# EAGLE design QO100_control (EAGLE 7.3.0)
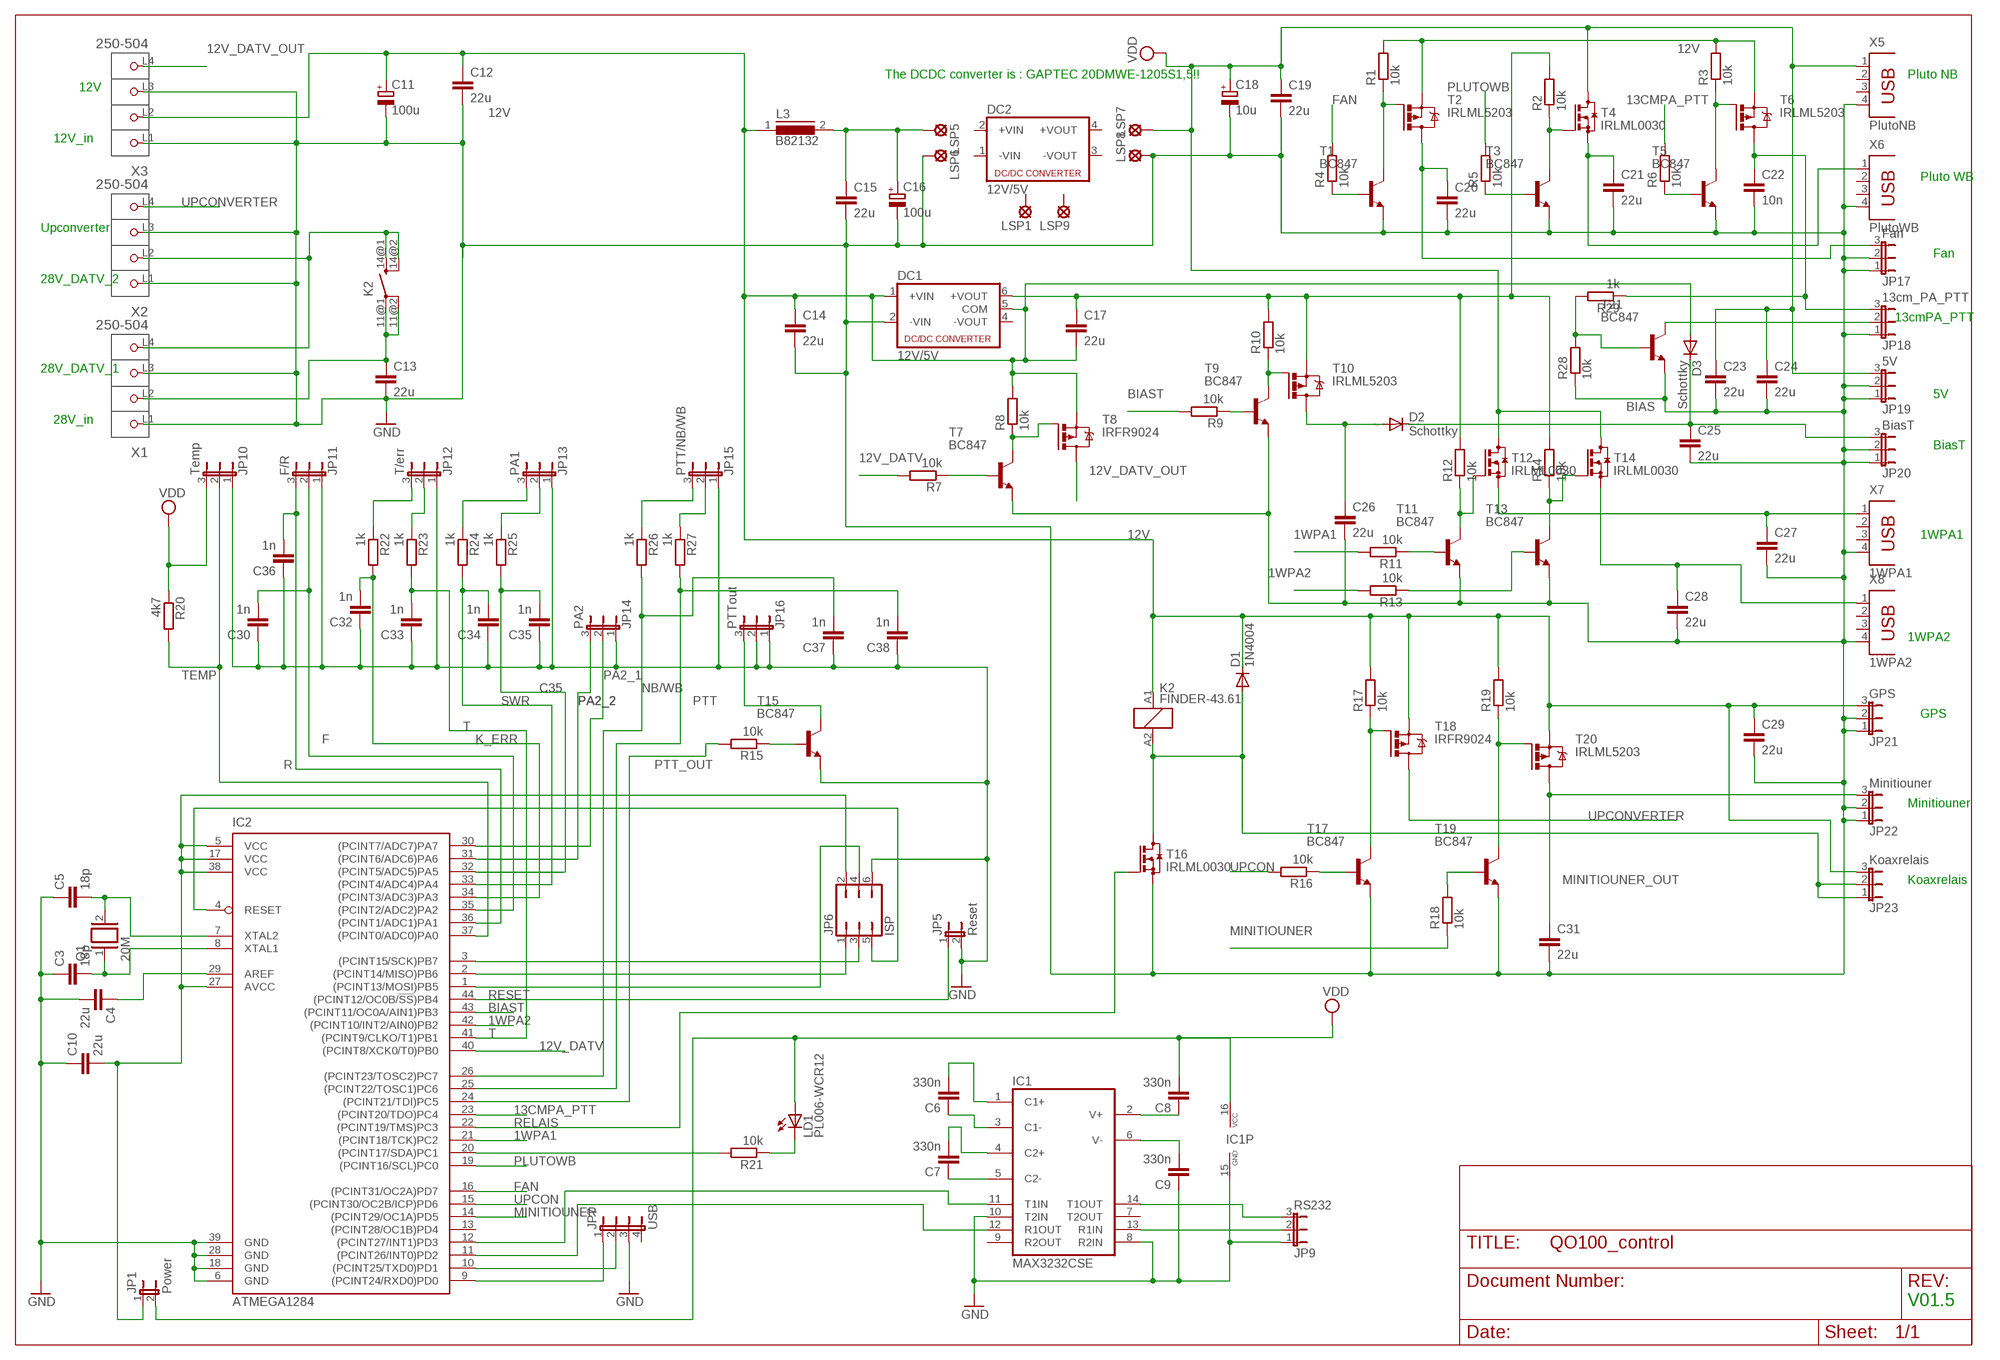
[diagram p0: schematic, sheet 1]

## Parts
C3  18p  C-EU025-025X050  [C025-025X050]
C4  22u  C-EUC1206  [C1206]
C5  18p  C-EU025-025X050  [C025-025X050]
C6  330n  C-EUC1206  [C1206]
C7  330n  C-EUC1206  [C1206]
C8  330n  C-EUC1206  [C1206]
C9  330n  C-EUC1206  [C1206]
C10  22u  C-EUC1206  [C1206]
C11  100u  CPOL-EUE5-6  [E5-6]
C12  22u  C-EUC1206  [C1206]
C13  22u  C-EUC1206  [C1206]
C14  22u  C-EUC1206  [C1206]
C15  22u  C-EUC1206  [C1206]
C16  100u  CPOL-EUE5-6  [E5-6]
C17  22u  C-EUC1206  [C1206]
C18  10u  CPOL-EUE5-6  [E5-6]
C19  22u  C-EUC1206  [C1206]
C20  22u  C-EUC1206  [C1206]
C21  22u  C-EUC1206  [C1206]
C22  10n  C-EUC1206  [C1206]
C23  22u  C-EUC1206  [C1206]
C24  22u  C-EUC1206  [C1206]
C25  22u  C-EUC1206  [C1206]
C26  22u  C-EUC1206  [C1206]
C27  22u  C-EUC1206  [C1206]
C28  22u  C-EUC1206  [C1206]
C29  22u  C-EUC1206  [C1206]
C30  1n  C-EUC1206  [C1206]
C31  22u  C-EUC1206  [C1206]
C32  1n  C-EUC1206  [C1206]
C33  1n  C-EUC1206  [C1206]
C34  1n  C-EUC1206  [C1206]
C35  1n  C-EUC1206  [C1206]
C36  1n  C-EUC1206  [C1206]
C37  1n  C-EUC1206  [C1206]
C38  1n  C-EUC1206  [C1206]
D1  1N4004  [DO41-10]
D2  Schottky  1N4004  [DO41-10]
D3  Schottky  1N4004  [DO41-10]
DC1  12V/5V  NMA  [NMA]
DC2  12V/5V  NME  [NME]
IC1  MAX3232CSE  [SO16]
IC2  ATMEGA1284  ATMEGA644A  [TQFP44]
JP1  Power  JP1E  [JP1]
JP5  Reset  JP1E  [JP1]
JP6  ISP  JP3Q  [JP3Q]
JP7  USB  JP4E  [JP4]
JP9  RS232  JP2E  [JP2]
JP10  Temp  JP2E  [JP2]
JP11  F/R  JP2E  [JP2]
JP12  T/err  JP2E  [JP2]
JP13  PA1  JP2E  [JP2]
JP14  PA2  JP2E  [JP2]
JP15  PTT/NB/WB  JP2E  [JP2]
JP16  PTTout  JP2E  [JP2]
JP17  Fan  JP2E  [JP2]
JP18  13cm_PA_PTT  JP2E  [JP2]
JP19  5V  JP2E  [JP2]
JP20  BiasT  JP2E  [JP2]
JP21  GPS  JP2E  [JP2]
JP22  Minitiouner  JP2E  [JP2]
JP23  Koaxrelais  JP2E  [JP2]
K2  FINDER-43.61  [FINDER-43.61]
L3  B82132  [SUKW2-22]
LD1  PL006-WCR12  [SOT23]
LSP1  SE14  [SE14]
LSP5  SE14  [SE14]
LSP6  SE14  [SE14]
LSP7  SE14  [SE14]
LSP8  SE14  [SE14]
LSP9  SE14  [SE14]
Q1  20M  XTAL/S  [QS]
R1  10k  R-EU_R1206  [R1206]
R2  10k  R-EU_R1206  [R1206]
R3  10k  R-EU_R1206  [R1206]
R4  10k  R-EU_R1206  [R1206]
R5  10k  R-EU_R1206  [R1206]
R6  10k  R-EU_R1206  [R1206]
R7  10k  R-EU_R1206  [R1206]
R8  10k  R-EU_R1206  [R1206]
R9  10k  R-EU_R1206  [R1206]
R10  10k  R-EU_R1206  [R1206]
R11  10k  R-EU_R1206  [R1206]
R12  10k  R-EU_R1206  [R1206]
R13  10k  R-EU_R1206  [R1206]
R14  10k  R-EU_R1206  [R1206]
R15  10k  R-EU_R1206  [R1206]
R16  10k  R-EU_R1206  [R1206]
R17  10k  R-EU_R1206  [R1206]
R18  10k  R-EU_R1206  [R1206]
R19  10k  R-EU_R1206  [R1206]
R20  4k7  R-EU_R1206  [R1206]
R21  10k  R-EU_R1206  [R1206]
R22  1k  R-EU_R1206  [R1206]
R23  1k  R-EU_R1206  [R1206]
R24  1k  R-EU_R1206  [R1206]
R25  1k  R-EU_R1206  [R1206]
R26  1k  R-EU_R1206  [R1206]
R27  1k  R-EU_R1206  [R1206]
R28  10k  R-EU_R1206  [R1206]
R29  1k  R-EU_R1206  [R1206]
T1  BC847  [SOT23]
T2  IRLML5203  [MICRO3]
T3  BC847  [SOT23]
T4  IRLML0030  BSS123  [SOT23]
T5  BC847  [SOT23]
T6  IRLML5203  [MICRO3]
T7  BC847  [SOT23]
T8  IRFR9024  IRFR5305  [D-PAK_TO252AA]
T9  BC847  [SOT23]
T10  IRLML5203  [MICRO3]
T11  BC847  [SOT23]
T12  IRLML0030  BSS123  [SOT23]
T13  BC847  [SOT23]
T14  IRLML0030  BSS123  [SOT23]
T15  BC847  [SOT23]
T16  IRLML0030  BSS123  [SOT23]
T17  BC847  [SOT23]
T18  IRFR9024  IRFR5305  [D-PAK_TO252AA]
T19  BC847  [SOT23]
T20  IRLML5203  [MICRO3]
T21  BC847  [SOT23]
X1  250-504  [P-250-504]
X2  250-504  [P-250-504]
X3  250-504  [P-250-504]
X5  PlutoNB  PN87520  [PN87520]
X6  PlutoWB  PN87520  [PN87520]
X7  1WPA1  PN87520  [PN87520]
X8  1WPA2  PN87520  [PN87520]

## Nets
1WPA1: IC2.21((PCINT18/TCK)PC2) R11.2
1WPA2: IC2.42((PCINT10/INT2/AIN0)PB2) R13.2
12V: C11.+ C12.1 C14.1 C17.2 C29.1 D1.C D3.A DC1.1(+VIN) DC1.5(COM) JP21.3 JP23.3 K2.A1 L3.1 R1.2 R3.2 R8.2 R17.2 R19.2 T2.2(S) T6.2(S) T8.3(S) T18.3(S) T20.2(S) X3.L2(P2)
12V_DATV: IC2.40((PCINT8/XCK0/T0)PB0) R7.2
12V_DATV_OUT: T8.4(D) X3.L4(P4)
13CMPA_PTT: IC2.23((PCINT20/TDO)PC4) R6.2
28V: K2.14@1(-1:SA) K2.14@2(-1:SB) X1.L4(P4) X2.L2(P2)
BIAS: C25.1 D2.C D3.C JP20.3
BIAST: IC2.43((PCINT11/OC0A/AIN1)PB3) R9.2
C35: C35.2 IC2.32((PCINT5/ADC5)PA5) R25.2
DFGJKN: C26.1 D2.A T10.3(D)
F: C30.2 IC2.35((PCINT2/ADC2)PA2) JP11.2
FAN: IC2.16((PCINT31/OC2A)PD7) R4.2
GND: C3.1 C4.2 C5.1 C9.1 C10.1 C11.- C12.2 C13.2 C14.2 C15.2 C16.- C18.- C19.2 C20.2 C21.2 C22.2 C23.2 C24.2 C25.2 C26.2 C27.2 C28.2 C29.2 C30.1 C31.2 C32.1 C33.1 C34.1 C35.1 C36.1 C37.1 C38.1 DC1.2(-VIN) IC1.8(R2IN) IC1.10(T2IN) IC1.15(GND) IC2.6(GND) IC2.18(GND) IC2.28(GND) IC2.39(GND) JP5.2 JP6.6 JP7.3 JP9.1 JP10.1 JP11.1 JP12.1 JP13.1 JP14.1 JP15.1 JP16.1 JP16.2 JP17.1 JP17.2 JP18.1 JP19.1 JP19.2 JP20.1 JP20.2 JP21.1 JP21.2 JP22.1 JP22.2 LSP6.MP LSP8.MP R28.1 T1.2(E) T3.2(E) T5.2(E) T7.2(E) T9.2(E) T11.2(E) T13.2(E) T15.2(E) T16.2(S) T17.2(E) T19.2(E) T21.2(E) X1.L1(P1) X1.L3(P3) X2.L1(P1) X2.L3(P3) X3.L1(P1) X3.L3(P3) X5.4 X6.4 X7.4 X8.4
K_ERR: C32.2 IC2.34((PCINT3/ADC3)PA3) R22.2
MINITIOUNER: IC2.14((PCINT29/OC1A)PD5) R18.1
MINITIOUNER_OUT: C31.1 JP22.3 T20.3(D)
N$1: IC2.20((PCINT17/SDA)PC1) R21.2
N$2: C22.1 JP18.3 R29.1 T6.3(D)
N$3: C28.1 T14.2(S) X8.1
N$4: IC2.3((PCINT15/SCK)PB7) JP6.3
N$5: R17.1 T17.3(C) T18.1(G)
N$6: C5.2 IC2.7(XTAL2) Q1.2
N$7: C15.1 C16.+ L3.2 LSP5.MP
N$8: R8.1 T7.3(C) T8.1(G)
N$9: LD1.3(C) R21.1
N$10: C3.2 IC2.8(XTAL1) Q1.1
N$11: R7.1 T7.1(B)
N$12: JP12.3 R22.1
N$13: IC2.2((PCINT14/MISO)PB6) JP6.1
N$14: C6.2 IC1.1(C1+)
N$15: IC2.1((PCINT13/MOSI)PB5) JP6.4
N$16: IC2.4(RESET) JP6.5
N$17: IC2.9((PCINT24/RXD0)PD0) JP7.1
N$18: IC2.10((PCINT25/TXD0)PD1) JP7.2
N$19: IC1.12(R1OUT) IC2.11((PCINT26/INT0)PD2)
N$20: C4.1 IC2.29(AREF)
N$21: IC1.11(T1IN) IC2.12((PCINT27/INT1)PD3)
N$22: JP12.2 R23.1
N$23: JP13.2 R25.1
N$24: JP13.3 R24.1
N$25: JP15.3 R26.1
N$26: C27.1 T12.2(S) X7.1
N$27: JP15.2 R27.1
N$28: D1.A JP23.1 JP23.2 K2.A2 T16.3(D)
N$29: C6.1 IC1.3(C1-)
N$30: C7.1 IC1.5(C2-)
N$31: C7.2 IC1.4(C2+)
N$32: JP18.2 T21.3(C)
N$33: IC1.14(T1OUT) JP9.3
N$34: C9.2 IC1.6(V-)
N$35: C8.1 IC1.2(V+)
N$36: IC1.13(R1IN) JP9.2
N$38: R28.2 R29.2 T21.1(B)
N$40: R3.1 T5.3(C) T6.1(G)
N$41: JP16.3 T15.3(C)
N$42: C21.1 T4.2(S) X6.1
N$43: R15.1 T15.1(B)
N$44: R19.1 T19.3(C) T20.1(G)
N$45: R10.1 T9.3(C) T10.1(G)
N$46: R6.1 T5.1(B)
N$47: C20.1 JP17.3 T2.3(D)
N$48: R2.1 T3.3(C) T4.1(G)
N$49: R12.1 T11.3(C) T12.1(G)
N$50: R1.1 T1.3(C) T2.1(G)
N$51: C17.1 DC1.6(+VOUT) R2.2 R10.2 R12.2 R14.2 T10.2(S)
N$52: R14.1 T13.3(C) T14.1(G)
N$53: R4.1 T1.1(B)
N$54: R5.1 T3.1(B)
N$55: R9.1 T9.1(B)
N$56: R11.1 T11.1(B)
N$57: R13.1 T13.1(B)
N$58: R16.1 T17.1(B)
N$59: C13.1 K2.11@1(-1:PA) K2.11@2(-1:PB) X1.L2(P2)
N$60: R18.2 T19.1(B)
NB/WB: C37.2 IC2.26((PCINT23/TOSC2)PC7) R26.2
PA2_1: IC2.30((PCINT7/ADC7)PA7) JP14.2
PA2_2: IC2.31((PCINT6/ADC6)PA6) JP14.3
PLUTOWB: IC2.19((PCINT16/SCL)PC0) R5.2
PTT: C38.2 IC2.25((PCINT22/TOSC1)PC6) R27.2
PTT_OUT: IC2.24((PCINT21/TDI)PC5) R15.2
R: C36.2 IC2.36((PCINT1/ADC1)PA1) JP11.3
RELAIS: IC2.22((PCINT19/TMS)PC3) T16.1(G)
RESET: IC2.44((PCINT12/OC0B/!SS!)PB4) JP5.1
SWR: C34.2 IC2.33((PCINT4/ADC4)PA4) R24.2
T: C33.2 IC2.41((PCINT9/CLKO/T1)PB1) R23.2
TEMP: IC2.37((PCINT0/ADC0)PA0) JP10.2 R20.2
UPCON: IC2.15((PCINT30/OC2B/ICP)PD6) R16.2
UPCONVERTER: T18.4(D) X2.L4(P4)
VCC: C10.2 IC2.5(VCC) IC2.17(VCC) IC2.27(AVCC) IC2.38(VCC) JP1.1 JP6.2
VDD: C8.2 C18.+ C19.1 C23.1 C24.1 IC1.16(VCC) JP1.2 JP10.3 JP19.3 LD1.1(A) LSP7.MP R20.1 T4.3(D) T12.3(D) T14.3(D) X5.1
Unconnected: DC1.4(-VOUT) DC2.1(-VIN) DC2.2(+VIN) DC2.3(-VOUT) DC2.4(+VOUT) IC1.7(T2OUT) IC1.9(R2OUT) IC2.13((PCINT28/OC1B)PD4) JP7.4 LSP1.MP LSP9.MP X5.2 X5.3 X6.2 X6.3 X7.2 X7.3 X8.2 X8.3

## Notes on the sheet
- The DCDC converter is : GAPTEC 20DMWE-1205S1,5!! | Pluto NB
- 12V
- 12V_in
- Pluto WB
- Upconverter
- Fan
- 28V_DATV_2
- 13cmPA_PTT
- 28V_DATV_1
- 5V
- 28V_in
- BiasT
- 1WPA1
- 1WPA2
- GPS
- Minitiouner
- Koaxrelais
- V01.5

## Library data of the parts
C3 C5 = rcl:C-EU: CAPACITOR, European symbol
C4 C6-C10 C12-C15 C17 C19-C38 = resistor:C-EU: CAPACITOR, European symbol
C11 C16 C18 = resistor:CPOL-EU: POLARIZED CAPACITOR, European symbol
D1-D3 = diode:1N4004: DIODE general purpose rectifier, 1 A
DC1 = dc-dc-converter:NMA: DC-DC CONVERTER; MF: C & D TECHNOLOGIES, INC; MPN: NMA0515SC; OC_FARNELL: 1021434; OC_NEWARK: 61K3064
DC2 = dc-dc-converter:NME: DC-DC CONVERTER; MF: C & D TECHNOLOGIES, INC; MPN: NME1205D; OC_FARNELL: 1021466; OC_NEWARK: 98B8198
IC1 = maxim:MAX3232*: True RS-232 Transceivers 3.0V to 5.5V, Low-Power up to 1Mbps, Using Four 0.1µF External Capacitors Source: http://pdfserv.maxim-ic.com/en/ds/MAX3222-MAX3241.pdf; MPN: MAX3232CSE; OC_FARNELL: 9725490; OC_NEWARK: 90C2890
IC2 = atmel:ATMEGA644: 8-bit Microcontroller with 64K Bytes In-System Programmable Flash Source: http://www.atmel.com/dyn/resources/prod_documents/doc2593.pdf; MPN: ATMEGA644PV-10AU; OC_FARNELL: 1455123; OC_NEWARK: 58M3748
JP1 JP5 = jumper:JP1E: JUMPER
JP6 = jumper:JP3Q: JUMPER
JP7 = jumper:JP4E: JUMPER
JP9-JP23 = jumper:JP2E: JUMPER
K2 = relay:FINDER-43.61: Low profile PCB relays 10 - 16 A FINDER 43 Series Kontakt max. AC- 250V, Strom - Kontakt AC- max. 10A 5 mm contact pin pitch, 1 Pole NO, 16 A, PCB mount Distributor: FARNELL Source: http://www.farnell.com/datasheets/87682.pdf; OC_FARNELL: unknown; OC_NEWARK: unknown
L3 = inductors:B82132: INDUCTOR
LD1 = led:PL006*: PLH006 Series SMD LED SOT23 PLH006-WCR21 Super Red PLH006-WCR12 High Eff Red PLH006-WCG13 Green PLH006-WCY01 Yellow www.p-tec.net Source: http://www.wittig-electronic.de/PTEC/PL006Series.pdf
LSP1 LSP5-LSP9 = solpad:SE14: SOLDER PAD E1553, drill 1,4mm, distributor Buerklin, 07F820
Q1 = special:XTAL/S: CRYSTAL
R1-R29 = rcl:R-EU_: RESISTOR, European symbol
T1 T3 T5 T7 T9 T11 T13 T15 T17 T19 T21 = transistor:BC847: NPN TRANSISTOR
T2 T6 T10 T20 = transistor-power:IRLML5203: HEXFET P-Channel Power MOSFET
T4 T12 T14 T16 = transistor-small-signal:BSS123: N-CHANNEL MOS FET
T8 T18 = transistor-power:IRF?5305: HEXFET Power MOSFET Source: http://www.irf.com/product-info/datasheets/data/irfr5305pbf.pdf
X1-X3 = 250-504:250-504: Serie 250, 1-Leiter-Klemmenleiste für Leiterplatten 1 Lötstift/Pol in Reihe / Series 250, 1-conductor PCB terminal strip 1 solder pin/pole, in line Polzahl / Pole No.: 4 Rastermaß / Pitch: 5 mm Bemessungsspannung / Rated Voltage: 320 V Nennstrom / Nominal Current: 17.5 A Leiterquerschnitt / Conductor Size: 0.5 - 1.5 mm² Anschlusstechnik / Connection Technology: Steckklemm-Anschluss Lötstiftlänge: / Solder Pin Length: 4 mm Leitereinführung (zur Platine) / Conductor entry angle (to PCB): 45 ° Farbe / Color: grau / gray Stand: 01.01.2012. Die jeweils aktuellen Daten zu diesem Artikel finden Sie in unserem Produktkatalog, den Sie unter www.wago.com einsehen können. As of: 01/01/2012. Please find the newest data for this article in our product catalogue, which can be viewed under www.wago.com. Check availability <https://pricing.snapeda.com/parts/250-504/WAGO/view-part?ref=eda>; AVAILABILITY: In Stock; DESCRIPTION: PCB Terminal Block Rating to EN: 10 A @ 400 VAC/VDC Rating to UL/CSA: 2 A @ 300 VAC/VDC Temperature range: -35 ... +105 °C Connection cross-section: 0.5...1.5 mm² solid or stranded Combustibility class: UL 94 V-0 Connection direction: 45° Housing Material: Polyamide (PA 66) Pitch: 5 mm Termination type: Spring Clamp Terminals Poles: 4 Rated current to EN: 10 A Rated current to UL/CSA: 2 A Rated voltage to EN: 400 VAC/VDC Rated voltage to UL/CSA: 300 VAC/VDC; MF: WAGO; MP: 250-504; PACKAGE: None; PRICE: None; PURCHASE-URL: https://pricing.snapeda.com/search/part/250-504/?ref=eda
X5-X8 = con-berg:PN87520: BERG USB connector; OC_FARNELL: unknown; OC_NEWARK: unknown

## Board
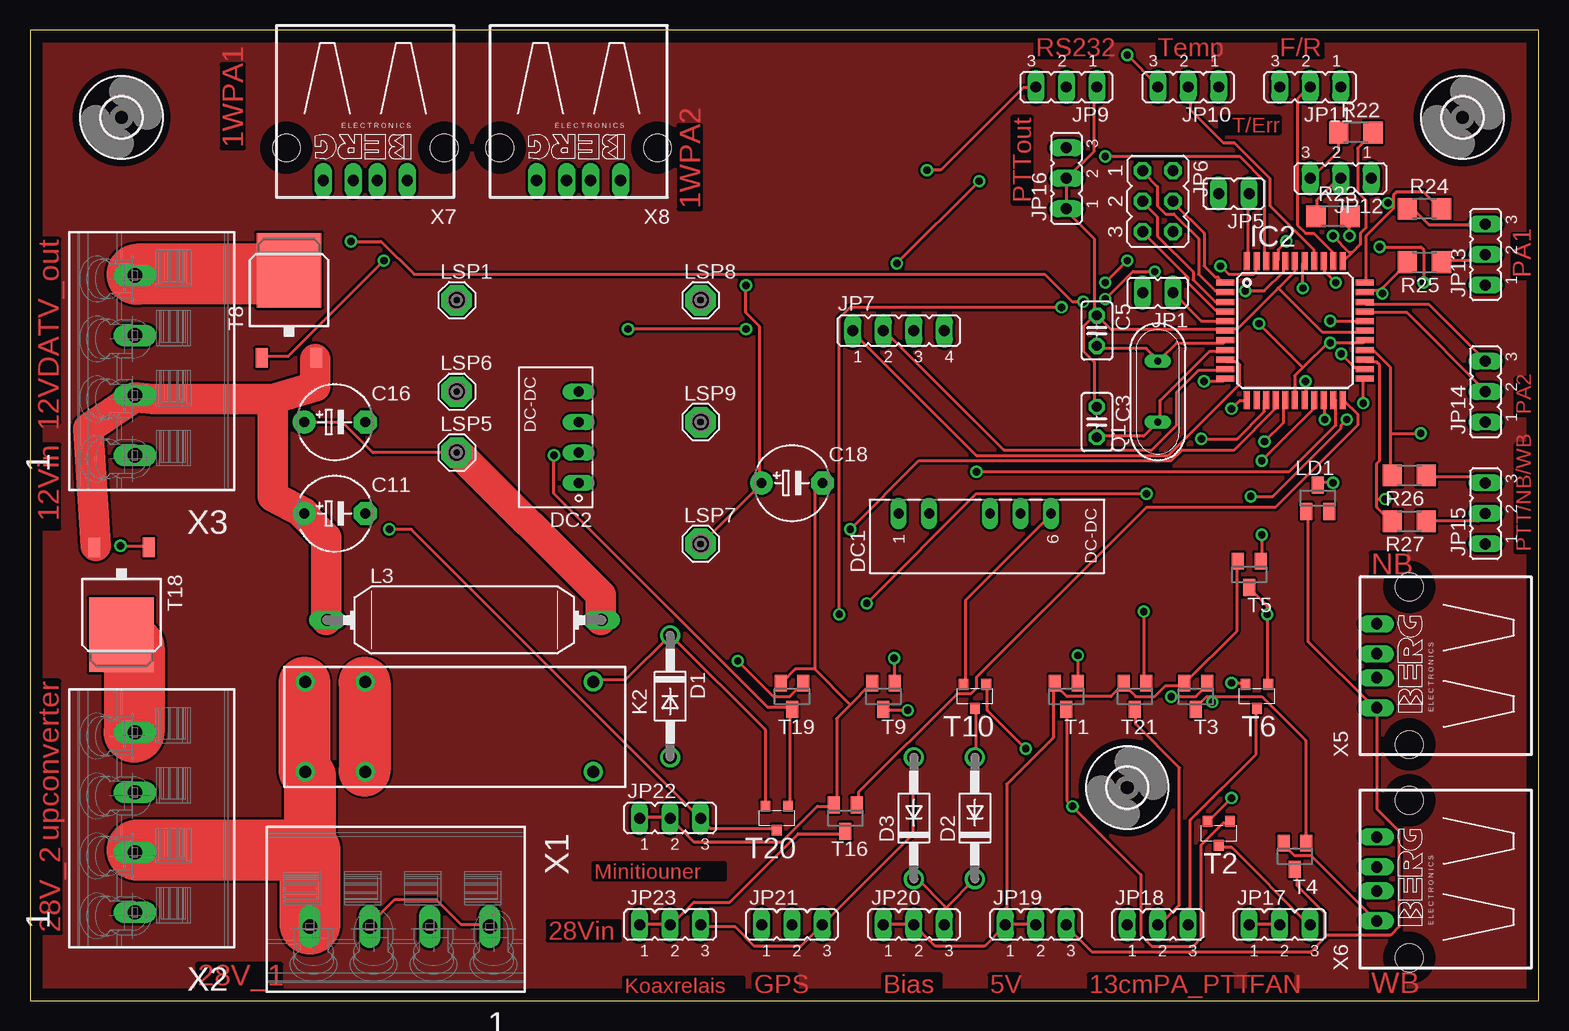
[diagram p1: board, top side]
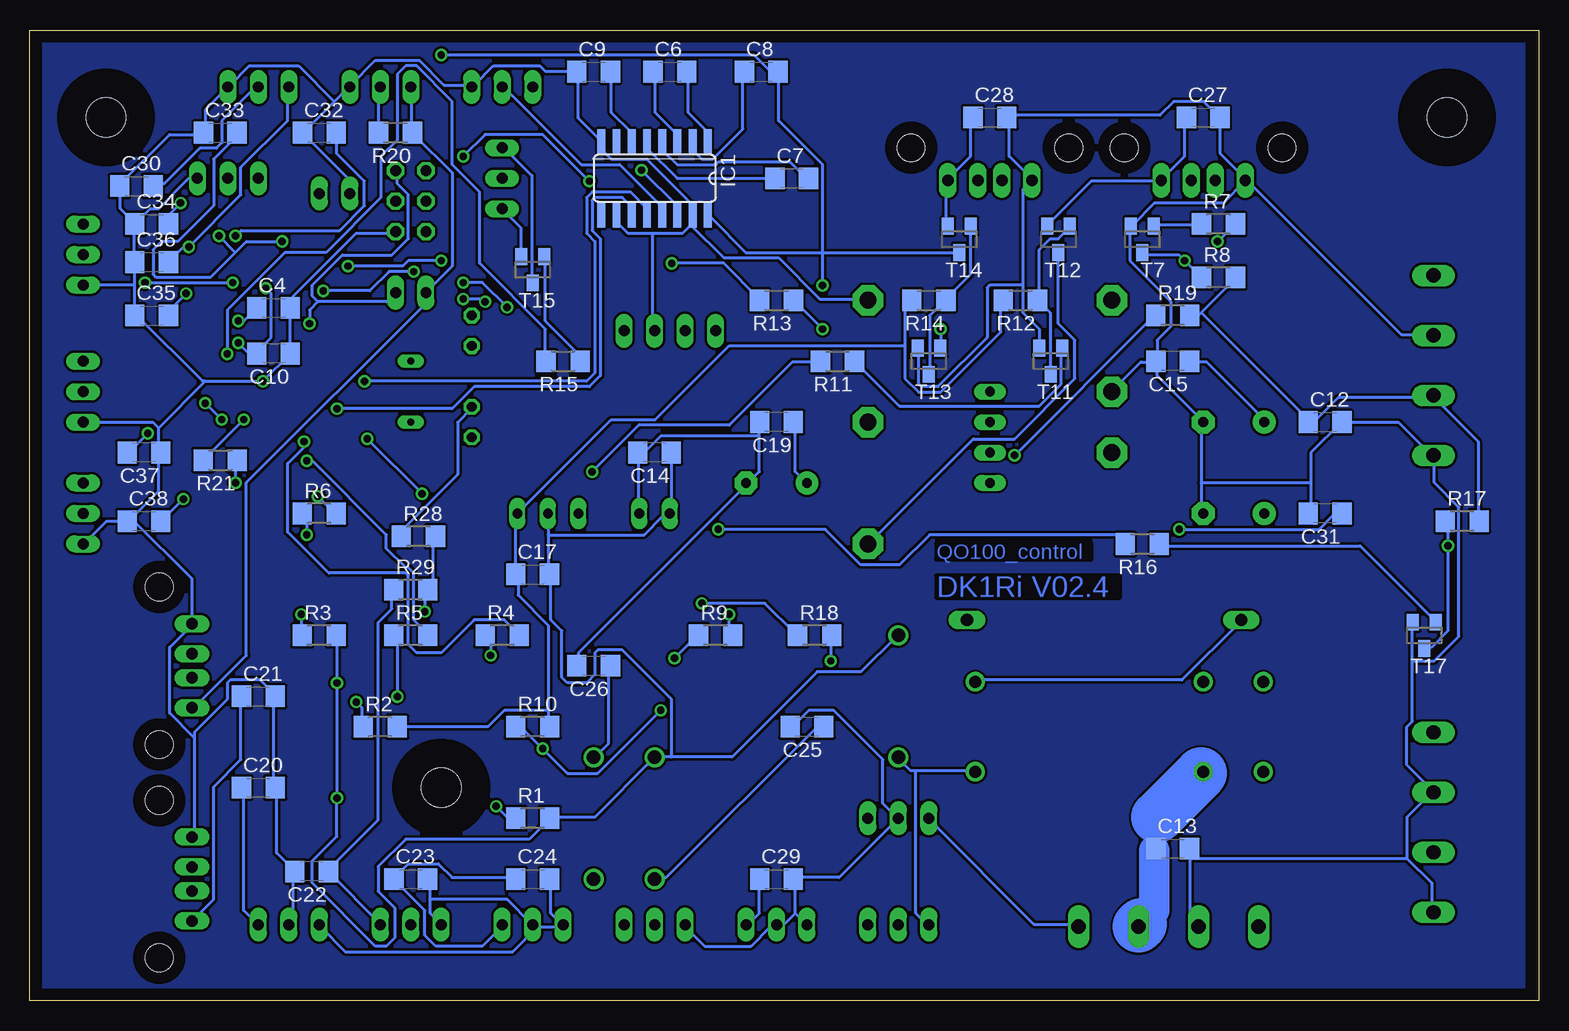
[diagram p2: board, bottom side, seen from below]

Size 125.71 x 80.95 mm. Coordinates in mm from the lower left corner, seen from the top.
Outline: 0,0 125.71,0 125.71,80.95 0,80.95 0,0
Copper layers (1*16): Top 0.035mm / dielectric 1.5mm / Bottom 0.035mm
Design rules "default": minimum track width 10mil, minimum drill 24mil, track to track 8mil, track to pad 8mil, pad to pad 8mil, via to via 8mil, smd to smd 8mil, copper to edge 40mil, drill to drill 8mil, minimum pad ring 10mil, minimum via ring 8mil, stop-mask expansion 4mil, vias tented up to drill 0mil, thermal gap 10mil

### Footprints (pad centres in the part's own frame; a part is rotated, then mirrored left to right if it is on the bottom)
C025-025X050 = drill 0.813 octagon: 1 -1.27,0; 2 1.27,0
C1206 = smd 1.6 x 1.8: 1 -1.4,0; 2 1.4,0
E5-6 = drill 0.813 pad 1.905: + -2.54,0 | drill 0.813 pad 1.905 octagon: - 2.54,0
DO41-10 = drill 1.118: A 5.08,0; C -5.08,0
NMA = drill 0.813 long: 1 0,6.35; 2 0,3.81; 4 0,-1.27; 5 0,-3.81; 6 0,-6.35
NME = drill 0.813 long: 1 0,3.81; 2 0,1.27; 3 0,-1.27; 4 0,-3.81
SO16 = smd 0.66 x 2.032: 1 -4.445,-3.073; 2 -3.175,-3.073; 3 -1.905,-3.073; 4 -0.635,-3.073; 5 0.635,-3.073; 6 1.905,-3.073; 7 3.175,-3.073; 8 4.445,-3.073; 9 4.445,3.073; 10 3.175,3.073; 11 1.905,3.073; 12 0.635,3.073; 13 -0.635,3.073; 14 -1.905,3.073; 15 -3.175,3.073; 16 -4.445,3.073
TQFP44 = smd 1.5 x 0.5: 1 -5.8,4; 2 -5.8,3.2; 3 -5.8,2.4; 4 -5.8,1.6; 5 -5.8,0.8; 6 -5.8,0; 7 -5.8,-0.8; 8 -5.8,-1.6; 9 -5.8,-2.4; 10 -5.8,-3.2; 11 -5.8,-4; 23 5.8,-4; 24 5.8,-3.2; 25 5.8,-2.4; 26 5.8,-1.6; 27 5.8,-0.8; 28 5.8,0; 29 5.8,0.8; 30 5.8,1.6; 31 5.8,2.4; 32 5.8,3.2; 33 5.8,4 | smd 0.5 x 1.5: 12 -4,-5.8; 13 -3.2,-5.8; 14 -2.4,-5.8; 15 -1.6,-5.8; 16 -0.8,-5.8; 17 0,-5.8; 18 0.8,-5.8; 19 1.6,-5.8; 20 2.4,-5.8; 21 3.2,-5.8; 22 4,-5.8; 34 4,5.8; 35 3.2,5.8; 36 2.4,5.8; 37 1.6,5.8; 38 0.8,5.8; 39 0,5.8; 40 -0.8,5.8; 41 -1.6,5.8; 42 -2.4,5.8; 43 -3.2,5.8; 44 -4,5.8
JP1 = drill 0.914 long: 1 0,-1.27; 2 0,1.27
JP3Q = drill 0.914 octagon: 1 -2.54,-1.27; 2 -2.54,1.27; 3 0,-1.27; 4 0,1.27; 5 2.54,-1.27; 6 2.54,1.27
JP4 = drill 0.914 long: 1 -3.81,0; 2 -1.27,0; 3 1.27,0; 4 3.81,0
JP2 = drill 0.914 long: 1 -2.54,0; 2 0,0; 3 2.54,0
FINDER-43.61 = drill 1 pad 1.6: 11@1 0,3.75; 11@2 0,-3.75; 14@1 5,3.75; 14@2 5,-3.75; A1 -19,-3.75; A2 -19,3.75
SUKW2-22 = drill 1.016 long: 1 -11.43,0; 2 11.43,0
SOT23 = smd 1 x 1.4: 1 -0.95,-1.1; 2 0.95,-1.1; 3 0,1.1
SE14 = drill 1.397 pad 2.54 octagon: MP 0,0
QS = drill 0.61 long: 1 -2.54,0; 2 2.54,0
R1206 = smd 1.6 x 1.803: 1 -1.422,0; 2 1.422,0
MICRO3 = smd 0.8 x 0.9: 1 -0.95,-1; 2 0.95,-1; 3 0,1
D-PAK_TO252AA = smd 1 x 1.6: 1 -2.28,-4.8; 3 2.28,-4.8 | smd 5.4 x 6.2: 4 0,2.5
3,3 = hole 3.3: 0,0
P-250-504 = drill 1.2 long: L1 1.425,7.85; L2 1.425,2.85; L3 1.425,-2.15; L4 1.425,-7.15
PN87520 = drill 0.95 long: 1 -3.5,2.71; 2 -1,2.71; 3 1,2.71; 4 3.5,2.71 | hole 2.3: -6.57,0; 6.57,0

### Placement (x,y rotation side)
C3  88.9,48.26 270 top
C4  105.41,57.78 0 bottom
C5  88.9,55.88 270 top
C6  72.39,77.47 0 bottom
C7  62.23,68.58 0 bottom
C8  64.77,77.47 0 bottom
C9  78.74,77.47 0 bottom
C10  105.41,53.98 180 bottom
C11  25.4,40.64 0 top
C12  17.78,48.26 0 bottom
C13  30.48,12.7 0 bottom
C14  73.66,45.72 180 bottom
C15  30.48,53.34 180 bottom
C16  25.4,48.26 0 top
C17  83.82,35.56 0 bottom
C18  63.5,43.18 0 top
C19  63.5,48.26 180 bottom
C20  106.68,17.78 0 bottom
C21  106.68,25.4 0 bottom
C22  102.23,10.79 180 bottom
C23  93.98,10.16 0 bottom
C24  83.82,10.16 0 bottom
C25  60.96,22.86 180 bottom
C26  78.74,27.94 180 bottom
C27  27.94,73.66 0 bottom
C28  45.72,73.66 0 bottom
C29  63.5,10.16 0 bottom
C30  116.84,67.94 0 bottom
C31  17.78,40.64 180 bottom
C32  101.6,72.39 0 bottom
C33  109.86,72.39 0 bottom
C34  115.57,64.77 0 bottom
C35  115.57,57.15 0 bottom
C36  115.57,61.59 0 bottom
C37  116.2,45.72 180 bottom
C38  116.2,40.01 0 bottom
D1  53.34,25.4 270 top
D2  78.74,15.24 90 top
D3  73.66,15.24 90 top
DC1  78.74,40.64 90 top
DC2  45.72,46.99 180 top
IC1  73.66,68.58 180 bottom
IC2  105.41,55.88 0 top
JP1  93.98,59.05 90 top
JP5  100.33,67.31 90 top
JP6  93.98,66.67 270 top
JP7  72.39,55.88 0 top
JP9  86.36,76.2 180 top
JP10  96.52,76.2 180 top
JP11  106.68,76.2 180 top
JP12  109.22,68.58 180 top
JP13  121.28,62.23 90 top
JP14  121.28,50.8 90 top
JP15  121.28,40.64 90 top
JP16  86.36,68.58 90 top
JP17  104.14,6.35 0 top
JP18  93.98,6.35 0 top
JP19  83.82,6.35 0 top
JP20  73.66,6.35 0 top
JP21  63.5,6.35 0 top
JP22  53.34,15.24 0 top
JP23  53.34,6.35 0 top
K2  27.94,22.86 180 top
L3  36.2,31.75 0 top
LD1  107.31,41.91 0 top
LSP1  35.56,58.42 0 top
LSP5  35.56,45.72 0 top
LSP6  35.56,50.8 0 top
LSP7  55.88,38.1 0 top
LSP8  55.88,58.42 0 top
LSP9  55.88,48.26 0 top
Q1  93.98,50.8 90 top
R1  83.82,15.24 0 bottom
R2  96.52,22.86 0 bottom
R3  101.6,30.48 0 bottom
R4  86.36,30.48 0 bottom
R5  93.98,30.48 0 bottom
R6  101.6,40.64 0 bottom
R7  26.67,64.77 0 bottom
R8  26.67,60.33 0 bottom
R9  68.58,30.48 0 bottom
R10  83.82,22.86 0 bottom
R11  58.42,53.34 180 bottom
R12  43.18,58.42 180 bottom
R13  63.5,58.42 180 bottom
R14  50.8,58.42 180 bottom
R15  81.28,53.34 180 bottom
R16  33.02,38.1 180 bottom
R17  6.35,40.01 0 bottom
R18  60.33,30.48 0 bottom
R19  30.48,57.15 0 bottom
R20  95.25,72.39 180 bottom
R21  109.86,45.09 180 bottom
R22  110.49,72.39 0 top
R23  108.58,65.41 0 top
R24  116.2,66.04 0 top
R25  116.2,61.59 180 top
R26  114.94,43.81 180 top
R27  114.94,40.01 180 top
R28  93.34,38.73 0 bottom
R29  93.98,34.29 0 bottom
T1  86.36,25.4 180 top
T2  99.06,13.97 180 top
T3  97.16,25.4 180 top
T4  105.41,12.06 180 top
T5  101.6,35.56 180 top
T6  102.23,25.4 180 top
T7  33.02,63.5 180 bottom
T8  21.59,58.42 0 top
T9  71.12,25.4 180 top
T10  78.74,25.4 180 top
T11  40.64,53.34 180 bottom
T12  40.01,63.5 180 bottom
T13  50.8,53.34 180 bottom
T14  48.26,63.5 180 bottom
T15  83.82,60.96 180 bottom
T16  67.94,15.24 180 top
T17  9.53,30.48 180 bottom
T18  7.62,33.02 180 top
T19  63.5,25.4 180 top
T20  62.23,15.24 180 top
T21  92.08,25.4 180 top
U$1  [3,3]  7.62,73.66 0 top
U$2  [3,3]  119.38,73.66 0 top
U$3  [3,3]  91.44,17.78 0 top
X1  30.48,7.62 270 top
X2  10.16,15.24 180 top
X3  10.16,53.34 180 top
X5  114.94,27.94 90 top
X6  114.94,10.16 90 top
X7  27.94,71.12 180 top
X8  45.72,71.12 180 top

### Tracks (layer width: path | path; a pad name or v marks a point on that pad's centre or on a via)
1WPA1  (via drill 0.61)
  Top 0.254: v78.87,44.12 104.93,44.12 108.81,48.01 108.81,50.06 IC2.21
  Bottom 0.254: v78.87,44.12 74.98,48.01 67.44,48.01 62.18,53.26 59.89,53.26 R11.2
1WPA2  (via drill 0.61)
  Top 0.254: v89.61,70.41 100.81,70.41 102.87,68.35 102.87,61.72 IC2.42 | v72.24,61.49 v79.1,68.35
  Bottom 0.254: v89.61,70.41 87.78,72.24 82.98,72.24 v79.1,68.35 | v72.24,61.49 67.89,61.49 64.92,58.52 R13.2
12V  (via drill 0.61)
  Top 0.254: JP23.3 56.01,6.17 58.75,6.17 60.35,4.57 64.24,4.57 65.84,6.17 JP21.3 66.06,6.4 73.61,13.95 73.61,20.12 D3.A | T20.2 61.27,16.46 61.27,22.63 53.49,30.4 D1.C 49.61,26.75 47.09,26.75 K2.A1 | 23.77,53.49 T8.3 | 22.86,40.69 C11.+ 22.86,40.46 | 24.69,31.77 L3.1 | 5.49,37.95 T18.3 | 8.69,50.29 X3.L2 8.91,50.29 | v100.13,16.92 98.3,15.09 T2.2 | v100.13,26.52 101.27,26.52 T6.2
  Top 2.54: 23.77,53.49 23.77,51.21 20.22,50.19 | 20.22,50.19 20.22,42.06 22.86,40.69 | 24.69,31.77 24.69,38.63 22.86,40.46 | 5.49,37.95 4.85,47.73 8.69,50.29 | 20.22,50.19 10.29,50.19 8.91,50.29
  Bottom 0.254: C14.1 72.24,45.72 72.24,40.69 DC1.1 72.47,40.46 72.92,40.46 74.52,38.86 82.53,38.86 | 82.53,38.86 82.53,40.46 DC1.5 | 82.53,38.86 82.53,35.66 C17.2 82.3,35.43 82.3,31.77 81.38,30.86 81.38,26.98 80.92,26.52 79.32,26.52 78.64,27.2 78.64,29.03 78.41,29.26 76.35,29.26 72.24,25.15 72.24,20.34 | C29.1 64.92,10.06 64.92,7.32 65.84,6.4 JP21.3 | R19.2 28.35,57.15 28.12,57.38 | 28.12,57.38 25.38,60.12 R8.2 | R17.2 5.03,40.01 5.03,46.63 8.69,50.29 X3.L2 8.91,50.29 16.69,50.29 18.52,48.46 18.97,48.46 C12.1 19.2,48.46 28.12,57.38 | K2.A1 46.86,26.75 29.72,26.75 24.92,31.55 L3.1 | 72.24,20.34 67.21,20.34 60.12,27.43 56.46,27.43 53.49,30.4 D1.C | 72.24,20.34 73.61,20.34 D3.A 73.84,20.12 78.64,15.32 82.3,15.32 R1.2 82.53,15.09 84.12,13.49 94.41,13.49 96.7,11.2 96.7,9.14 95.33,7.77 95.33,5.26 96.01,4.57 96.93,4.57 102.18,9.83 102.18,11.66 100.13,13.72 v100.13,16.92 v100.13,26.52 100.13,30.4 R3.2
12V_DATV  (via drill 0.61)
  Top 0.254: v101.27,59.21 102.87,59.21 104.47,60.81 104.47,61.49 IC2.40 | v93.73,60.81 91.9,60.81 v89.61,58.52 | v87.78,58.29 86.87,58.29 84.58,60.58 32,60.58 29.26,63.32 v26.75,63.32
  Bottom 0.254: v101.27,59.21 97.38,59.21 95.78,60.81 v93.73,60.81 | v89.61,58.52 88.01,58.52 v87.78,58.29 | v26.75,63.32 25.38,64.69 R7.2
12V_DATV_OUT
  Top 0.254: 21.26,60.58 21.49,60.81 T8.4 | 8.91,60.58 X3.L4
  Top 5.08: 21.26,60.58 8.91,60.58
13CMPA_PTT  (via drill 0.61)
  Top 0.254: v111.1,49.84 111.1,51.66 IC2.23 | v109.73,48.46 109.27,48.01 109.27,47.78 103.56,42.06 v101.73,42.06
  Bottom 0.254: v109.73,48.46 v111.1,49.84 | v101.73,42.06 100.36,40.69 R6.2
28V
  Top 0.254: 22.86,19.2 K2.14@1 23.09,18.97 23.32,18.75 | 22.86,26.52 K2.14@2 | 23.32,6.4 X1.L4 | 8.91,12.57 X2.L2
  Top 4.318: 22.86,26.52 22.86,19.2 | 23.32,18.75 23.32,12.57
  Top 5.08: 23.32,6.4 23.32,12.57 8.91,12.57
BIAS
  Top 0.254: 76.35,7.77 76.35,6.4 JP20.3 | D2.C 76.35,7.77 | 76.35,7.77 73.84,10.29 D3.C
  Bottom 0.254: C25.1 60.12,22.86 72.69,10.29 73.61,10.29 D3.C
BIAST  (via drill 0.61)
  Top 0.254: v99.21,61.27 99.9,60.58 101.96,60.58 102.18,60.81 102.18,61.49 IC2.43 | v89.61,59.89 v91.44,61.72 | v85.95,57.84 68.35,57.84 67.44,56.92 v67.44,32.23
  Bottom 0.254: v99.21,61.27 94.64,61.27 94.18,61.72 v91.44,61.72 | v89.61,59.89 88.01,59.89 v85.95,57.84 | v67.44,32.23 67.44,30.86 67.21,30.63 R9.2
C35  (via drill 0.61)
  Top 0.254: 112.47,59.21 111.33,59.21 IC2.32 | 112.47,59.21 114.76,61.49 R25.2 | 112.47,59.21 v112.7,58.98
  Bottom 0.254: v112.7,58.98 114.07,57.61 114.07,57.15 C35.2
DFGJKN
  Top 0.254: T10.3 78.87,24.23 78.87,20.34 D2.A
  Bottom 0.254: C26.1 77.5,27.89 77.5,21.49 78.64,20.34 D2.A
F
  Top 0.254: IC2.35 108.58,61.72 108.58,62.41 106.98,64.01 106.3,64.01 105.61,64.69 105.61,75.21 106.53,76.12 JP11.2
  Bottom 0.254: C30.2 115.21,68.12 114.53,68.12 111.56,71.09 110.19,71.09 109.73,71.55 109.73,73.38 106.76,76.35 JP11.2
FAN  (via drill 0.61)
  Top 0.254: v102.87,46.63 104.47,48.23 104.47,50.06 IC2.16
  Bottom 0.254: v102.87,46.63 102.87,46.18 104.24,44.81 104.24,39.09 100.81,35.66 94.41,35.66 94.18,35.43 94.18,29.72 93.5,29.03 91.44,29.03 88.7,31.77 86.18,31.77 85.04,30.63 R4.2
GND  (via drill 0.61)
  Top 0.254: 104.01,59.44 105.39,60.81 105.39,61.49 IC2.39 | 104.01,59.44 100.58,56.01 99.67,56.01 IC2.6 99.44,56.01 90.07,56.01 88.92,57.15 C5.1 88.7,57.15 | 104.01,59.44 107.67,55.78 111.1,55.78 IC2.28 | 88.7,57.15 87.78,56.24 87.78,54.18 88.7,53.26 88.7,49.61 C3.1 | 86.41,68.58 86.41,66.06 JP16.1 86.41,65.84 88.7,63.55 88.7,57.15 | 86.41,68.58 88.7,70.87 88.7,76.12 JP9.1 | 86.41,68.58 JP16.2 | v106.3,51.66 106.3,50.29 IC2.18 | JP20.1 71.32,6.4 73.61,6.4 JP20.2 75.44,4.57 79.55,4.57 81.15,6.17 JP19.1 81.38,6.4 | 68.35,24.69 69.95,26.29 T9.2 | 68.35,24.69 67.21,23.55 67.21,16.46 T16.2 66.98,16.23 65.61,16.23 62.64,13.26 55.32,13.26 JP22.2 53.26,15.32 50.98,15.32 JP22.1 | 65.38,27.66 63.78,27.66 62.64,26.52 T19.2 | 68.35,24.69 65.38,27.66 | 65.38,27.66 65.38,42.52 C18.- | X1.L1 38.18,6.4 35.89,6.4 33.83,8.46 30.4,8.46 28.35,6.4 X1.L3 | 81.38,6.4 83.67,6.4 JP19.2 | T5.2 100.58,36.58 100.58,30.86 96.24,26.52 T3.2 96.01,26.29 94.64,26.29 93.73,25.38 92.13,25.38 91.21,26.29 T21.2 90.98,26.29 90.07,25.38 86.41,25.38 85.5,26.29 T1.2 85.27,26.29 85.27,21.95 81.38,18.06 81.38,6.4 | JP17.1 101.73,6.4 104.01,6.4 JP17.2
  Bottom 0.254: 70.64,64.69 70.64,65.38 IC1.15 | 70.64,64.69 71.32,64.01 73.84,64.01 | 73.84,64.01 75.89,64.01 76.81,64.92 76.81,65.38 IC1.10 | 73.84,64.01 73.84,56.01 JP7.3 | 70.64,64.69 67.89,61.95 63.32,61.95 59.89,58.52 56.01,58.52 LSP8.MP | 70.64,64.69 IC1.15 | T15.2 84.81,62.18 84.81,64.47 86.18,65.84 JP16.1 | IC1.15 70.64,65.61 70.64,66.52 74.3,70.18 77.27,70.18 77.95,70.87 77.95,71.55 IC1.8 78.18,71.78 80.01,73.61 80.01,77.27 C9.1 80.24,77.5 82.75,77.5 83.21,77.95 87.1,77.95 88.7,76.35 JP9.1 88.92,76.35 91.21,76.35 93.27,78.41 96.93,78.41 98.98,76.35 JP10.1 99.21,76.12 100.36,74.98 | 100.36,74.98 102.87,72.47 C32.1 102.87,72.24 99.21,68.58 99.21,67.44 JP5.2 | 117.04,59.66 117.04,61.49 C36.1 117.04,61.72 117.04,64.69 C34.1 | 117.04,59.66 117.04,57.15 C35.1 116.81,57.15 111.33,51.66 111.1,51.66 | C34.1 117.04,64.92 118.19,66.06 118.19,67.89 C30.1 118.19,68.12 114.07,72.24 111.33,72.24 C33.1 111.1,72.47 111.1,74.3 109.27,76.12 JP11.1 109.04,76.35 107.44,77.95 103.33,77.95 100.36,74.98 | 117.04,59.66 121.16,59.66 JP13.1 | JP12.1 112.47,68.58 114.99,66.06 115.67,66.06 116.81,64.92 C34.1 | JP6.6 95.33,64.01 98.53,64.01 103.78,58.75 103.78,57.84 C4.2 104.01,57.61 104.01,54.18 C10.1 104.01,53.95 v106.3,51.66 111.1,51.66 | C38.1 119.33,40.01 121.16,38.18 JP15.1 | 114.99,45.72 114.99,42.52 117.27,40.23 | 117.27,40.23 117.5,40.01 C38.1 | 114.99,47.78 115.44,48.23 121.16,48.23 JP14.1 | 114.99,45.72 114.99,47.78 | 114.99,45.72 C37.1 | 117.27,40.23 112.24,35.2 112.24,31.55 X5.4 112.24,31.32 114.07,29.49 114.07,24 112.01,21.95 | 117.27,40.23 C38.1 | 114.99,47.78 111.1,51.66
  Bottom 0.254: 112.01,21.95 112.01,22.4 109.27,25.15 109.27,26.52 109.04,26.75 106.53,26.75 105.39,25.6 C21.2 105.39,25.38 105.39,17.83 C20.2 105.16,17.6 105.16,12.34 103.78,10.97 C22.2 103.78,10.74 103.78,6.63 104.01,6.4 JP17.2 | 112.01,21.95 112.01,13.72 X6.4 | 61.95,7.32 61.95,10.06 C29.2 61.95,10.29 58.29,10.29 JP22.2 53.49,15.32 54.63,16.46 54.63,20.12 58.75,24.23 60.81,24.23 62.18,22.86 C25.2 | 61.95,7.32 61.04,6.4 JP21.1 | 61.95,7.32 62.87,6.4 63.32,6.4 JP21.2 63.55,6.17 64.01,6.17 65.61,4.57 69.49,4.57 71.09,6.17 JP20.1 | 18.97,43.2 18.97,45.72 16.46,48.23 C12.2 16.23,48.23 11.66,48.23 8.91,45.49 X3.L1 8.69,45.26 8.69,43.2 6.63,41.15 6.63,30.4 8.69,28.35 10.52,28.35 | 18.97,43.2 18.97,40.69 C31.2 | C15.2 32,53.26 33.15,53.26 35.43,50.98 LSP6.MP | 28.12,43.2 28.12,48.23 C16.- 28.12,48.46 31.77,52.12 31.77,53.26 C15.2 | 28.12,43.2 28.12,40.69 C11.- | 28.12,43.2 18.97,43.2 | 42.98,59.66 42.98,67.67 42.29,68.35 X8.4 42.29,68.58 44.12,70.41 44.12,73.61 C28.2 44.12,73.84 31.55,73.84 30.4,74.98 27.89,74.98 26.75,73.84 C27.2 26.52,73.61 26.52,70.64 24.46,68.58 X7.4 | 42.98,59.66 42.98,57.38 41.6,56.01 41.6,54.63 T11.2 | 42.98,59.66 45.72,59.66 45.95,59.44 45.95,55.32 50.06,51.21 51.44,51.21 51.66,51.44 51.66,54.41 T13.2 | X7.4 24.46,68.35 26.29,66.52 32,66.52 33.83,64.69 T7.2 34.06,64.47 34.06,61.72 30.63,58.29 30.63,56.24 31.77,55.09 31.77,53.49 C15.2 | X3.L3 8.91,55.55 11.43,55.55 24.23,68.35 X7.4 | 74.98,45.72 74.98,40.69 DC1.2 | C26.2 80.01,28.12 80.01,29.03 66.06,42.98 C18.- 65.84,43.2 64.92,44.12 64.92,47.09 | 64.92,47.09 64.92,48.23 C19.2
  Bottom 0.254: 74.98,45.72 74.52,45.72 73.15,47.09 64.92,47.09 | 74.98,45.72 C14.2 | 10.52,28.35 10.52,23.32 10.97,22.86 10.97,19.66 8.91,17.6 X2.L3 8.91,17.37 10.97,15.32 10.97,11.89 | 10.52,28.35 10.52,31.55 T17.2 | 10.97,11.89 8.91,9.83 8.91,7.54 X2.L1 | 29.03,11.89 29.03,7.09 28.35,6.4 X1.L3 | 29.03,11.89 29.03,12.57 C13.2 29.03,11.89 | X1.L1 38.41,6.4 42.06,6.4 50.75,15.09 JP22.1 | 29.03,11.89 10.97,11.89 | 92.35,8.46 92.35,7.32 91.44,6.4 JP18.1 | 92.35,8.46 92.35,10.06 C23.2 | C24.2 82.3,10.06 82.3,7.32 81.38,6.4 JP19.1 81.38,6.17 83.44,6.17 85.5,4.12 99.44,4.12 101.5,6.17 JP17.1 | 92.35,8.46 85.95,8.46 83.9,6.4 JP19.2 | R28.1 94.64,38.86 94.64,39.32 90.07,43.89 90.07,48.23 88.92,49.38 C3.1
K_ERR  (via drill 0.61)
  Top 0.254: 110.19,62.41 110.87,63.09 110.87,64.01 111.33,64.47 111.33,66.75 110.64,67.44 110.64,71.09 111.78,72.24 R22.2 | 110.19,62.41 109.5,61.72 IC2.34 | v108.58,63.78 109.96,62.41 110.19,62.41
  Bottom 0.254: v108.58,63.78 108.13,64.24 99.9,64.24 97.84,66.29 97.84,68.35 100.13,70.64 100.13,72.24 C32.2
MINITIOUNER  (via drill 0.61)
  Top 0.254: v97.61,46.86 100.58,46.86 102.87,49.15 102.87,50.06 IC2.14 | v93.04,42.29 78.87,42.29 v69.72,33.15
  Bottom 0.254: v93.04,42.29 v97.61,46.86 | v69.72,33.15 64.47,33.15 61.95,30.63 R18.1
MINITIOUNER_OUT  (via drill 0.61)
  Top 0.254: T20.3 62.18,14.4 56.69,14.4 56.01,15.09 JP22.3 55.78,15.32 31.77,39.32 v29.95,39.32
  Bottom 0.254: v29.95,39.32 18.29,39.32 17.14,40.46 16.46,40.46 C31.1
N$1  (via drill 0.61)
  Top 0.254: v107.9,48.46 107.9,50.06 IC2.20
  Bottom 0.254: v107.9,48.46 111.1,45.26 R21.2
N$2
  Top 0.254: T6.3 102.18,24.23 102.18,20.57 96.7,15.09 96.7,6.4 JP18.3
  Bottom 0.254: JP18.3 96.47,6.4 100.81,10.74 C22.1 100.81,10.97 96.7,15.09 96.7,31.55 95.56,32.69 95.56,34.29 R29.1
N$3
  Bottom 0.254: T14.2 49.38,64.69 49.38,68.35 X8.1 49.15,68.58 47.32,70.41 47.32,73.61 C28.1
N$4
  Top 0.254: IC2.3 99.44,58.29 98.75,58.29 96.93,60.12 96.93,60.81 93.95,63.78 93.95,65.38 92.81,66.52 JP6.3
N$5  (via drill 0.61)
  Top 0.254: v7.54,37.95 9.83,37.95 T18.1
  Bottom 0.254: T17.3 9.37,29.49 8.91,29.49 7.54,30.86 v7.54,37.95 7.54,40.01 R17.1
N$6
  Top 0.254: IC2.7 99.44,54.86 95.56,54.86 94.18,53.49 Q1.2 93.95,53.49 93.04,54.41 88.92,54.41 C5.2
N$7
  Top 0.254: 47.55,31.77 L3.2 | 35.66,45.72 LSP5.MP 28.57,45.72 26.06,48.23 22.86,48.23 C16.+
  Top 2.54: 47.55,31.77 47.55,33.83 35.66,45.72
  Bottom 0.254: C15.1 29.03,53.26 27.66,53.26 22.86,48.46 C16.+
N$8  (via drill 0.61)
  Top 0.254: v29.49,61.72 21.49,53.72 19.43,53.72 T8.1
  Bottom 0.254: T7.3 32.92,62.18 29.95,62.18 v29.49,61.72 28.12,60.35 R8.1
N$9  (via drill 0.61)
  Top 0.254: v108.58,43.2 107.44,43.2 LD1.3
  Bottom 0.254: v108.58,43.2 108.58,45.03 R21.1
N$10
  Top 0.254: IC2.8 99.44,54.18 98.3,54.18 94.18,50.06 94.18,48.46 Q1.1 92.81,47.09 88.92,47.09 C3.2
N$11
  Bottom 0.254: T7.1 32,64.69 28.12,64.69 R7.1
N$12
  Top 0.254: R22.1 109.04,72.24 109.04,70.87 106.76,68.58 JP12.3
N$13
  Top 0.254: IC2.2 99.44,59.21 98.75,59.21 97.38,60.58 97.38,63.55 95.33,65.61 94.64,65.61 93.95,66.29 93.95,67.89 92.81,69.04 JP6.1
N$14
  Bottom 0.254: C6.2 70.87,77.27 70.87,74.07 69.27,72.47 69.27,71.78 IC1.1
N$15
  Top 0.254: IC2.1 99.44,59.89 98.98,60.35 98.75,60.35 97.84,61.27 97.84,64.01 95.33,66.52 JP6.4
N$16
  Top 0.254: IC2.4 99.44,57.61 98.75,57.61 96.47,59.89 96.47,60.35 92.81,64.01 JP6.5
N$17
  Top 0.254: IC2.9 99.67,53.26 100.58,53.26 100.81,53.03 100.81,51.44 94.87,45.49 78.87,45.49 68.58,55.78 JP7.1
N$18
  Top 0.254: IC2.10 99.44,52.58 97.38,52.58 95.56,50.75 95.56,48.01 93.5,45.95 81.15,45.95 71.32,55.78 JP7.2
N$19  (via drill 0.61)
  Top 0.254: v97.84,51.66 99.44,51.66 IC2.11
  Bottom 0.254: v97.84,51.66 79.32,51.66 78.64,52.35 78.64,63.32 79.32,64.01 79.32,66.98 78.87,67.44 75.67,67.44 74.3,66.06 IC1.12
N$20  (via drill 0.61)
  Top 0.254: v108.36,56.69 111.1,56.69 IC2.29
  Bottom 0.254: v108.36,56.69 107.9,56.69 106.98,57.61 C4.1
N$21  (via drill 0.61)
  Top 0.254: v100.13,49.38 100.81,50.06 101.27,50.06 IC2.12
  Bottom 0.254: v100.13,49.38 90.53,49.38 88.7,51.21 79.1,51.21 78.18,52.12 78.18,63.55 78.87,64.24 78.87,66.75 78.64,66.98 76.35,66.98 75.67,66.29 75.67,65.61 IC1.11
N$22
  Top 0.254: R23.1 107.21,65.61 107.21,66.75 109.04,68.58 JP12.2
N$23
  Top 0.254: R25.1 117.73,61.72 120.7,61.72 121.16,62.18 JP13.2
N$24
  Top 0.254: R24.1 114.99,65.84 115.44,65.84 116.59,64.69 121.16,64.69 JP13.3
N$25
  Top 0.254: R26.1 116.36,43.66 120.7,43.66 121.16,43.2 JP15.3
N$26
  Bottom 0.254: T12.2 40.92,64.69 37.26,68.35 31.55,68.35 X7.1 31.32,68.58 29.49,70.41 29.49,73.61 C27.1
N$27
  Top 0.254: R27.1 120.7,40.01 121.16,40.46 JP15.2
N$28
  Top 0.254: T16.3 67.89,13.95 64.01,13.95 58.29,8.23 55.32,8.23 53.49,6.4 JP23.2 53.26,6.4 50.98,6.4 JP23.1
  Bottom 0.254: 51.89,19.2 52.35,19.2 53.26,20.12 D1.A | 51.89,19.2 47.09,19.2 K2.A2 | 51.89,19.2 51.89,7.32 50.98,6.4 JP23.1
N$29
  Bottom 0.254: C6.1 73.61,77.27 73.61,74.07 71.78,72.24 71.78,71.78 IC1.3
N$30
  Bottom 0.254: C7.1 71.78,68.58 74.3,71.09 IC1.5
N$31
  Bottom 0.254: C7.2 61.04,68.58 62.41,69.95 68.35,69.95 68.58,69.72 71.78,69.72 72.92,70.87 72.92,71.55 IC1.4
N$32
  Top 0.254: T21.3 92.13,24.23 92.13,23.09 95.78,19.43 95.78,8 94.18,6.4 JP18.2
N$33  (via drill 0.61)
  Top 0.254: v74.75,69.27 75.89,69.27 82.75,76.12 83.67,76.12 JP9.3
  Bottom 0.254: v74.75,69.27 71.78,66.29 71.78,65.61 IC1.14
N$34
  Bottom 0.254: C9.2 77.27,77.27 77.27,74.07 75.67,72.47 75.67,71.78 IC1.6
N$35
  Bottom 0.254: C8.1 66.29,77.27 66.29,72.69 68.81,70.18 69.72,70.18 70.41,70.87 70.41,71.55 IC1.2
N$36
  Bottom 0.254: IC1.13 73.15,65.61 73.15,66.29 76.58,69.72 79.78,69.72 86.18,76.12 JP9.2
N$37
  pour Bottom: 1.27,80.01 125.09,80.01 125.09,0.64 1.27,0.64
N$38  (via drill 0.61)
  Top 0.254: v92.81,32.46 92.81,26.52 T21.1
  Bottom 0.254: v92.81,32.46 92.81,34.06 92.58,34.29 R29.2 92.35,34.29 92.13,34.52 92.13,38.63 R28.2
N$39
  pour Top: 1.27,80.01 125.09,80.01 125.09,0.64 1.27,0.64
N$40  (via drill 0.61)
  Top 0.254: T6.1 103.1,26.52 v103.1,32.23 103.1,32.92 101.73,34.29 T5.3
  Bottom 0.254: v103.1,32.23 103.1,30.63 R3.1
N$41
  Bottom 0.254: T15.3 83.9,59.89 83.9,68.81 86.18,71.09 JP16.3
N$42
  Top 0.254: T4.2 104.47,13.03 105.39,12.12 106.76,12.12 112.01,6.86 X6.1
  Bottom 0.254: C21.1 108.13,25.38 108.13,20.12 110.41,17.83 110.41,8.46 112.01,6.86 X6.1
N$43
  Bottom 0.254: T15.1 82.75,61.95 82.75,56.69 80.01,53.95 80.01,53.49 R15.1
N$44  (via drill 0.61)
  Top 0.254: T20.1 63.32,16.46 63.32,24.23 T19.3 63.32,24.46 61.49,24.46 43.66,42.29 v43.66,45.49
  Bottom 0.254: v43.66,45.49 32,57.15 R19.1
N$45  (via drill 0.61)
  Top 0.254: v82.98,21.03 79.78,24.23 79.78,26.29 T10.1 | v73.15,24.23 71.32,24.23 T9.3
  Bottom 0.254: R10.1 84.81,22.86 v82.98,21.03 80.92,18.97 78.41,18.97 v73.15,24.23
N$46  (via drill 0.61)
  Top 0.254: v102.64,38.86 102.64,36.8 T5.1
  Bottom 0.254: v102.64,38.86 102.64,40.23 102.87,40.46 R6.1
N$47
  Top 0.254: T2.3 99.21,12.8 100.13,12.8 106.53,6.4 JP17.3
  Bottom 0.254: JP17.3 106.76,6.4 107.9,7.54 107.9,17.6 C20.1
N$48  (via drill 0.61)
  Top 0.254: 98.53,25.38 98.07,25.38 97.16,24.46 T3.3 | 98.53,25.38 102.64,25.38 106.3,21.72 106.3,13.26 T4.1 | 98.53,25.38 v98.53,24.92
  Bottom 0.254: v98.53,24.92 98.07,24.46 98.07,22.86 R2.1
N$49
  Bottom 0.254: T12.1 39.09,64.47 40.01,63.55 40.69,63.55 41.6,62.64 41.6,58.52 R12.1 41.6,58.29 40.69,57.38 40.69,52.35 T11.3
N$50  (via drill 0.61)
  Top 0.254: T2.1 99.9,14.86 99.44,14.86 97.61,13.03 97.61,5.26 96.93,4.57 93.5,4.57 92.58,5.49 92.58,10.52 v86.87,16.23 86.41,16.69 86.41,24.23 T1.3
  Bottom 0.254: v86.87,16.23 85.95,15.32 85.27,15.32 R1.1
N$51
  Top 0.254: T10.2 77.95,26.52 77.95,33.38 85.04,40.46 DC1.6
  Bottom 0.254: 52.81,54.63 52.81,57.84 52.35,58.29 R14.2 | 52.81,54.63 52.81,51.89 51.66,50.75 49.84,50.75 44.81,55.78 44.81,58.29 R12.2 | 52.81,54.63 67.44,54.63 73.61,48.46 77.27,48.46 DC1.6 85.27,40.46 85.27,35.66 C17.1 85.04,35.43 85.04,33.83 82.53,31.32 82.53,24.23 | 82.53,24.23 82.53,22.86 R10.2 | R2.2 87.55,22.86 86.18,24.23 82.53,24.23
N$52
  Bottom 0.254: T14.1 47.32,64.47 47.32,60.58 49.38,58.52 R14.1 49.61,58.29 50.75,57.15 50.75,52.35 T13.3
N$53  (via drill 0.61)
  Top 0.254: v87.33,28.8 87.33,26.52 T1.1
  Bottom 0.254: v87.33,28.8 87.33,30.18 87.55,30.4 R4.1
N$54  (via drill 0.61)
  Top 0.254: v95.1,25.38 97.16,25.38 98.07,26.29 T3.1
  Bottom 0.254: v95.1,25.38 95.1,30.18 95.33,30.4 R5.1
N$55  (via drill 0.61)
  Top 0.254: v72.01,28.57 72.01,26.52 T9.1
  Bottom 0.254: v72.01,28.57 70.18,30.4 R9.1
N$56
  Bottom 0.254: T11.1 39.78,54.41 39.78,51.44 41.6,49.61 53.26,49.61 56.92,53.26 R11.1
N$57  (via drill 0.61)
  Top 0.254: v59.66,56.01 v49.84,56.01
  Bottom 0.254: v49.84,56.01 49.84,54.63 T13.1 | v59.66,56.01 61.95,58.29 R13.1
N$58
  Bottom 0.254: T17.1 8.69,31.77 14.86,37.95 31.55,37.95 R16.1
N$59
  Top 0.254: 27.89,19.2 K2.11@1 | 27.89,26.52 K2.11@2
  Top 4.318: 27.89,26.52 27.89,19.2
  Bottom 0.254: 33.15,6.4 32,7.54 | 32,12.57 C13.1 31.77,12.8 31.77,15.32 | 28.12,18.97 K2.11@1
  Bottom 2.54: 32,7.54 32,12.57
  Bottom 4.318: 33.15,6.4 X1.L2 | 28.12,18.97 31.77,15.32
N$60  (via drill 0.61)
  Top 0.254: v58.98,28.35 61.95,25.38 63.32,25.38 64.24,26.29 T19.1
  Bottom 0.254: v58.98,28.35 58.98,30.4 R18.2
NB/WB  (via drill 0.61)
  Top 0.254: 113.39,47.32 113.39,43.89 R26.2 | 113.39,47.32 113.39,52.81 112.01,54.18 111.33,54.18 IC2.26 | 113.39,47.32 v115.9,47.32
  Bottom 0.254: v115.9,47.32 117.5,45.72 C37.2
PA2_1
  Top 0.254: IC2.30 111.33,57.38 114.76,57.38 121.16,50.98 JP14.2
PA2_2
  Top 0.254: IC2.31 111.33,58.06 116.59,58.06 121.16,53.49 JP14.3
PLUTOWB  (via drill 0.61)
  Top 0.254: v102.64,45.03 106.98,49.38 106.98,50.06 IC2.19
  Bottom 0.254: v102.64,45.03 102.18,45.03 96.01,38.86 96.01,37.72 94.41,36.12 94.18,36.12 93.73,35.66 93.73,31.77 92.58,30.63 R5.2
PTT  (via drill 0.61)
  Top 0.254: 112.24,41.83 112.24,41.15 113.39,40.01 R27.2 | 112.24,41.83 112.24,44.81 112.47,45.03 112.47,53.03 112.24,53.26 111.33,53.26 IC2.25 | 112.24,41.83 v112.93,41.83
  Bottom 0.254: v112.93,41.83 114.76,40.01 C38.2
PTT_OUT  (via drill 0.61)
  Top 0.254: v109.27,53.95 110.41,52.81 111.1,52.81 IC2.24
  Bottom 0.254: v109.27,53.95 109.27,57.61 104.47,62.41 101.04,62.41 96.47,66.98 96.47,70.41 95.1,71.78 95.1,77.27 94.41,77.95 93.5,77.95 90.53,74.98 90.53,69.72 88.24,67.44 88.24,61.49 82.75,56.01 82.75,53.49 R15.2
R  (via drill 0.61)
  Top 0.254: v108.81,59.89 107.9,60.81 107.9,61.49 IC2.36 | v116.13,59.89 116.13,62.64 115.9,62.87 v112.47,62.87
  Bottom 0.254: v116.13,59.89 v108.81,59.89 | C36.2 114.07,61.72 112.93,62.87 v112.47,62.87 108.13,67.21 108.13,69.49 104.24,73.38 104.24,76.12 JP11.3
RELAIS
  Top 0.254: T16.1 69.04,16.46 69.04,17.37 77.27,25.6 78.41,25.6 78.87,26.06 78.87,26.98 93.04,41.15 103.78,41.15 110.64,48.01 110.64,48.92 109.5,50.06 IC2.22
RESET
  Top 0.254: IC2.44 101.5,61.72 101.5,67.21 JP5.1
SWR  (via drill 0.61)
  Top 0.254: 113.61,66.52 113.61,67.21 113.84,67.44 116.13,67.44 117.5,66.06 R24.2 | 113.61,66.52 113.61,66.06 111.33,63.78 111.33,59.89 IC2.33 | 113.61,66.52 v113.16,66.52
  Bottom 0.254: v113.16,66.52 114.07,65.61 114.07,64.92 C34.2
T  (via drill 0.61)
  Top 0.254: v104.7,63.32 104.01,62.64 104.01,61.72 IC2.41 | v109.96,63.78 109.96,65.38 R23.2
  Bottom 0.254: v104.7,63.32 107.67,63.32 108.58,62.41 | 108.58,62.41 110.64,60.35 115.21,60.35 115.44,60.58 115.44,62.64 114.76,63.32 113.39,63.32 110.41,66.29 110.41,70.18 108.36,72.24 C33.2 | 108.58,62.41 v109.96,63.78
TEMP
  Top 0.254: IC2.37 106.98,61.72 106.98,62.64 103.33,66.29 103.33,68.58 100.36,71.55 99.44,71.55 96.7,74.3 96.7,76.12 JP10.2
  Bottom 0.254: R20.2 96.7,72.47 96.7,76.12 JP10.2
UPCON  (via drill 0.61)
  Top 0.254: v68.35,39.32 74.07,45.03 95.1,45.03 96.01,45.95 100.36,45.95 103.78,49.38 103.78,50.06 IC2.15
  Bottom 0.254: v68.35,39.32 59.44,39.32 56.46,36.35 53.26,36.35 50.75,38.86 35.2,38.86 34.52,38.18 R16.2
UPCONVERTER
  Top 0.254: 8.69,29.49 7.77,30.4 T18.4 | 8.69,22.4 X2.L4
  Top 5.08: 8.69,29.49 8.69,22.4
VCC  (via drill 0.61)
  Top 0.254: v106.07,59.44 106.07,61.49 IC2.38 | 106.07,52.81 108.13,54.86 v108.36,54.86 111.1,54.86 IC2.27 | 106.07,52.81 105.39,52.12 105.39,50.29 IC2.17 | JP1.1 97.61,56.69 99.44,56.69 IC2.5 | v102.41,56.46 106.07,52.81
  Bottom 0.254: v106.07,59.44 105.61,58.98 105.61,55.32 106.76,54.18 C10.2 106.98,54.18 107.67,54.18 v108.36,54.86 | 101.73,58.29 102.18,58.75 102.18,59.66 99.67,62.18 95.56,62.18 94.18,63.55 94.18,67.21 95.1,68.12 95.1,69.04 JP6.2 | 101.73,58.29 96.01,58.29 JP1.1 | v102.41,56.46 102.41,57.61 101.73,58.29
VDD  (via drill 0.61)
  Top 0.254: LSP7.MP 56.01,38.18 60.81,42.98 C18.+ 60.81,43.2 60.81,56.24 59.66,57.38 v59.66,59.66 | LD1.1 106.53,40.69 106.53,29.95 112.01,24.46 X5.1 112.24,24.23 112.24,16 114.07,14.17 114.07,6.17 113.39,5.49 107.9,5.49 | v91.44,78.87 93.95,76.35 JP10.3 | 107.9,5.49 107.9,5.26 106.76,4.12 88.47,4.12 86.41,6.17 JP19.3 | 107.9,5.49 107.9,7.32 105.61,9.6 105.61,10.74 T4.3
  Bottom 0.254: 59.66,62.41 66.06,62.41 69.04,65.38 IC1.16 | 59.66,62.41 48.46,62.41 T14.3 | 59.66,62.41 59.66,69.72 63.32,73.38 63.32,77.27 C8.2 63.55,77.5 64.01,77.5 65.38,78.87 v91.44,78.87 | C19.1 61.95,48.23 61.95,44.12 61.04,43.2 C18.+ | T12.3 40.01,56.46 38.63,55.09 38.63,51.89 43.66,46.86 47.09,46.86 55.78,38.18 LSP7.MP | v59.66,59.66 59.66,62.41 | JP10.3 93.95,76.12 93.95,72.47 R20.1 93.73,72.24 90.53,69.04 90.53,61.27 92.58,59.21 JP1.2 92.81,58.98 92.81,58.06 107.67,43.2 107.67,28.8 112.01,24.46 X5.1 | C24.1 85.27,10.29 90.53,10.29 91.67,11.43 94.18,11.43 95.33,10.29 C23.1 95.33,10.06 92.81,7.54 92.81,5.49 91.9,4.57 88.01,4.57 86.41,6.17 JP19.3

### Text on the board
Top: RS232 | Temp | F/R | PTTout | T/Err | 1WPA1 | 1WPA2 | 12VDATV_out | PA1 | PA2 | 12Vin | PTT/NB/WB | NB | upconverter | Minitiouner | 28V_2 | 28Vin | 28V_1 | Koaxrelais | GPS | Bias | 5V | 13cmPA_PTT | FAN | WB
Bottom: QO100_control | DK1Ri V02.4